# EasyEDA schematic SCH_ESP32C3-haedtracker_2026-03-10.json
TITLE: Sheet_1; REV: 1.0; Date: 2026-03-10; Sheet: 1/1; Drawn By: duwnsskan; Company: Your Company
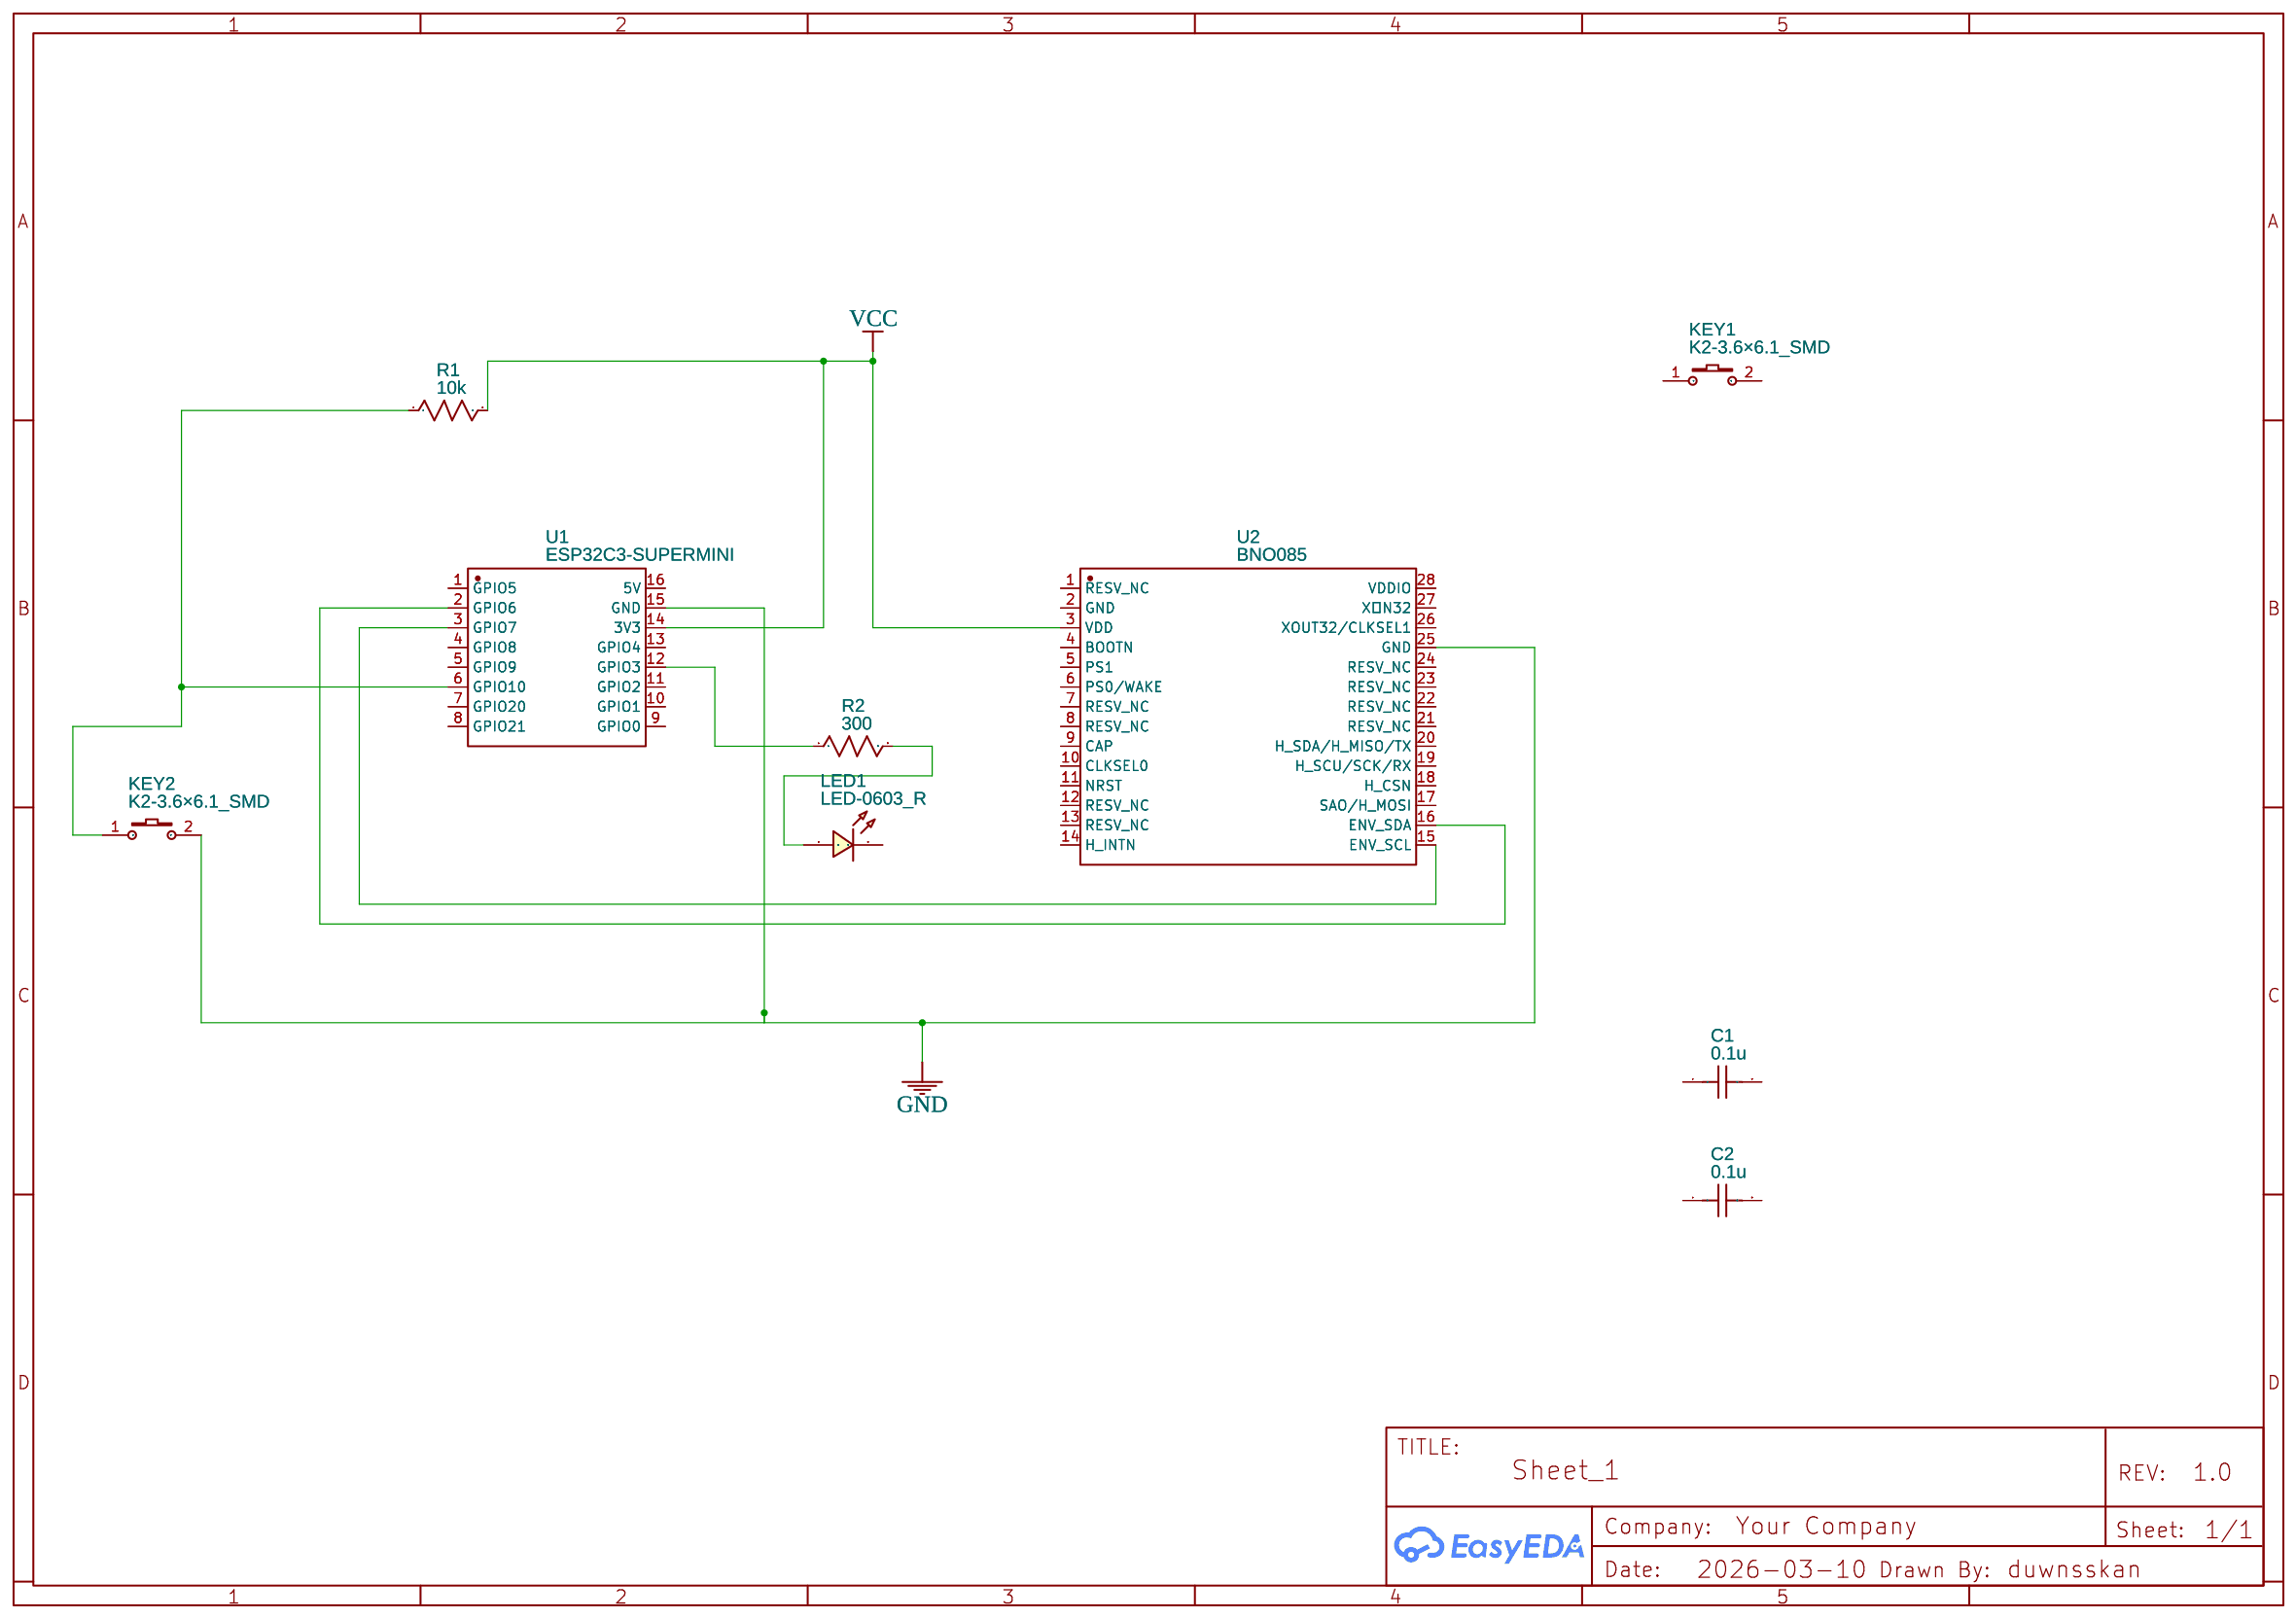
[diagram p0: schematic sheet]

## Parts
C1  0.1u  [C0603]
C2  0.1u  [C0603]
KEY1  K2-3.6×6.1_SMD  [KEY-SMD_2P-L6.2-W3.6-LS8.0]
KEY2  K2-3.6×6.1_SMD  [KEY-SMD_2P-L6.2-W3.6-LS8.0]
LED1  LED-0603_R  [LED0603_RED]
R1  10k  [R0603]
R2  300  [R0603]
U1  ESP32C3-SUPERMINI  [COMM-SMD_16P-L22.5-W18.0-P2.54-TL]
U2  BNO085  [LGA-28_L5.2-W3.8-P0.50-BL-1]

## Library data of the parts
C1 C2 = C_0603_US: Contributor: LCEDA_Lib
KEY1 KEY2 = K2-3.6×6.1_SMD: Supplier Part: C118141; Supplier: LCSC; Manufacturer Part: K2-1107ST-A4SW-06; Contributor: LCEDA_Lib; 制造商: 韩国韩荣
LED1 = LED-0603_R: Manufacturer: EVERLIGHT(台湾亿光); Manufacturer Part: 19-217/R6C-AL1M2VY/3T; Supplier Part: C72044; Supplier: LCSC; Contributor: LCEDA_01
R1 R2 = R_0603_US: Contributor: LCEDA_Lib
U1 = ESP32C3-SUPERMINI: Supplier: LCSC; Supplier Part: C9900147397; Manufacturer: null; Manufacturer Part: ESP32C3-SuperMini; JLCPCB Part Class: Extended Part; Contributor: lcsc
U2 = BNO085: Supplier: LCSC; Supplier Part: C9900000640; Manufacturer: null; JLCPCB Part Class: Extended Part; Contributor: lcsc

## Nets
GND: KEY2.2 U1.15(GND) U2.25(GND)
VCC: R1.2 U1.14(3V3) U2.3(VDD)
Net-(KEY2-1): KEY2.1 R1.1 U1.6(GPIO10)
Net-(LED1-1): LED1.1 R2.2
Net-(R2-1): R2.1 U1.12(GPIO3)
Net-(U1-2): U1.2(GPIO6) U2.16(ENV_SDA)
Net-(U1-3): U1.3(GPIO7) U2.15(ENV_SCL)

Not connected (* = marked no-connect by the designer): C1 1 2; C2 1 2; KEY1 1 2; LED1 2; U1 1(GPIO5) 4(GPIO8) 5(GPIO9) 7(GPIO20) 8(GPIO21) 9(GPIO0) 10(GPIO1) 11(GPIO2) 13(GPIO4) 16(5V); U2 1(RESV_NC) 2(GND) 4(BOOTN) 5(PS1) 6(PS0/WAKE) 7(RESV_NC) 8(RESV_NC) 9(CAP) 10(CLKSEL0) 11(NRST) 12(RESV_NC) 13(RESV_NC) 14(H_INTN) 17(SAO/H_MOSI) 18(H_CSN) 19(H_SCU/SCK/RX) 20(H_SDA/H_MISO/TX) 21(RESV_NC) 22(RESV_NC) 23(RESV_NC) 24(RESV_NC) 26(XOUT32/CLKSEL1) 27(XⅪN32) 28(VDDIO)
